# EAGLE design TramontanaPico (EAGLE 8.6.0)
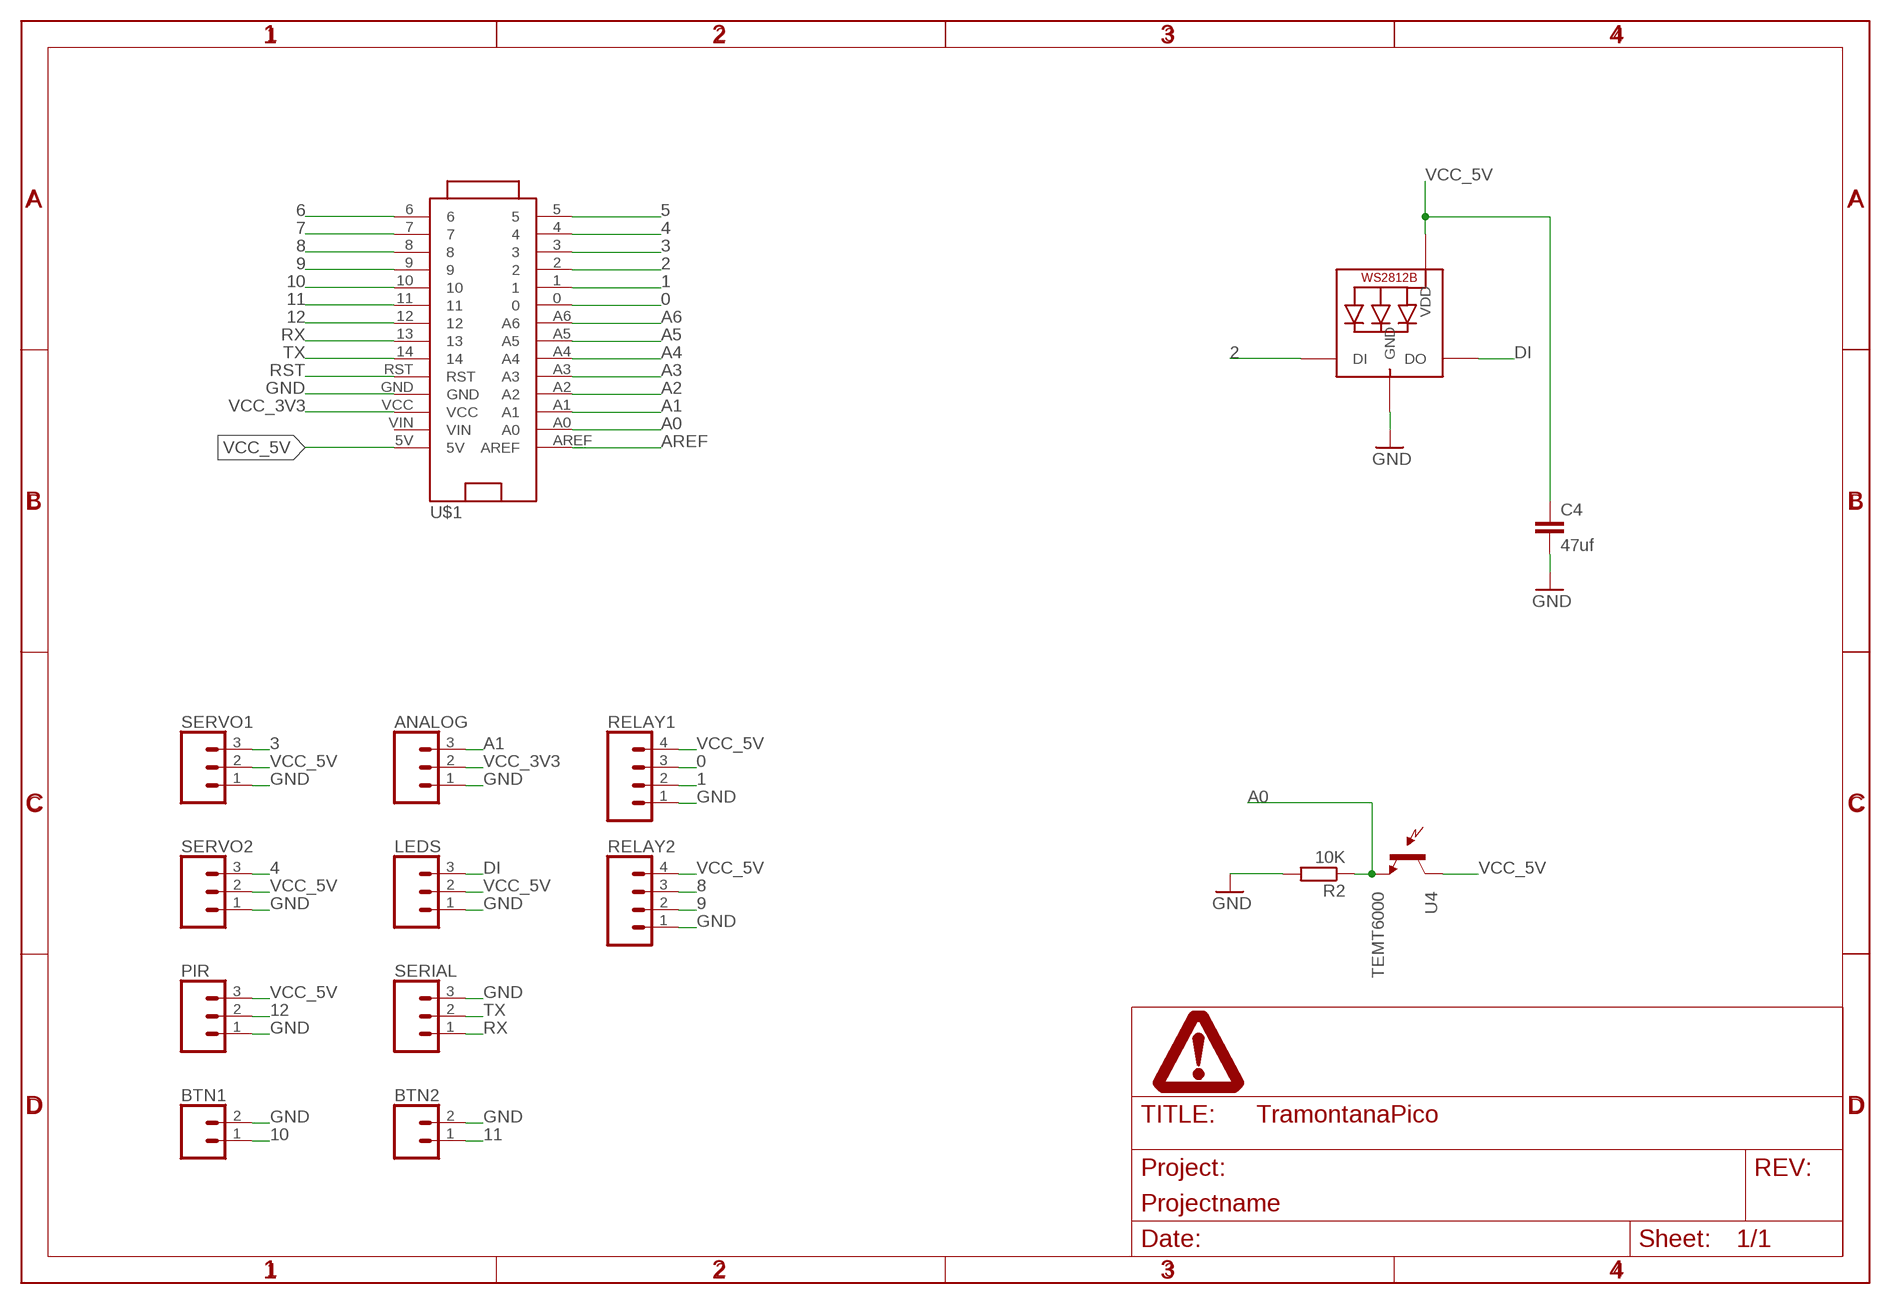
[diagram p0: schematic, sheet 1]

## Parts
ANALOG  CONN_03LOCK  [1X03_LOCK]
BTN1  CONN_02LOCK  [1X02_LOCK]
BTN2  CONN_02LOCK  [1X02_LOCK]
C4  47uf  C-EUC0603  [C0603]
HTTP  FRAME_DINA4_L  [DP_LOGO]
LED1  WS2812B5050  [WS2812B]
LEDS  CONN_03LOCK  [1X03_LOCK]
PIR  CONN_03LOCK  [1X03_LOCK]
R2  10K  R-EU_R0603  [R0603]
RELAY1  CONN_04LOCK  [1X04_LOCK]
RELAY2  CONN_04LOCK  [1X04_LOCK]
SERIAL  CONN_03LOCK  [1X03_LOCK]
SERVO1  CONN_03LOCK  [1X03_LOCK]
SERVO2  CONN_03LOCK  [1X03_LOCK]
U4  TEMT6000  [TEMT6000-SEN]
U$1  MKR1000  [MKR1000]

## Nets
0: RELAY1.3 U$1.0
1: RELAY1.2 U$1.1
2: LED1.4-DIN(DI) U$1.2
3: SERVO1.3 U$1.3
4: SERVO2.3 U$1.4
5: U$1.5
6: U$1.6
7: U$1.7
8: RELAY2.3 U$1.8
9: RELAY2.2 U$1.9
10: BTN1.1 U$1.10
11: BTN2.1 U$1.11
12: PIR.2 U$1.12
A0: R2.1 U4.EMITTER(E1) U$1.A0
A1: ANALOG.3 U$1.A1
A2: U$1.A2
A3: U$1.A3
A4: U$1.A4
A5: U$1.A5
A6: U$1.A6
AREF: U$1.AREF
DI: LED1.2-DOUT(DO) LEDS.3
GND: ANALOG.1 BTN1.2 BTN2.2 C4.2 LED1.3-GND(GND) LEDS.1 PIR.1 R2.2 RELAY1.1 RELAY2.1 SERIAL.3 SERVO1.1 SERVO2.1 U$1.GND
RST: U$1.RST
RX: SERIAL.1 U$1.13
TX: SERIAL.2 U$1.14
VCC_3V3: ANALOG.2 U$1.VCC
VCC_5V: C4.1 LED1.1-VDD(VDD) LEDS.2 PIR.3 RELAY1.4 RELAY2.4 SERVO1.2 SERVO2.2 U4.COLLECTOR(C1) U$1.5V
Unconnected: U$1.VIN

## Library data of the parts
ANALOG LEDS PIR SERIAL SERVO1 SERVO2 = SparkFun-Connectors:CONN_03: Multi connection point. Often used as Generic Header-pin footprint for 0.1 inch spaced/style header connections On any of the 0.1 inch spaced packages, you can populate with these: Break Away Headers - Straight <https://www.sparkfun.com/products/116> (PRT-00116) Break Away Male Headers - Right Angle <https://www.sparkfun.com/products/553> (PRT-00553) Female Headers <https://www.sparkfun.com/products/115> (PRT-00115) Break Away Headers - Machine Pin <https://www.sparkfun.com/products/117> (PRT-00117) Break Away Female Headers - Swiss Machine Pin <https://www.sparkfun.com/products/743> (PRT-00743) Stackable Header - 3 Pin (Female, 0.1") <https://www.sparkfun.com/products/13875> (PRT-13875) For SCREWTERMINALS and SPRING TERMINALS visit here: Screw Terimnals on SparkFun.com <https://www.sparkfun.com/search/results?term=Screw+Terminals> (5mm/3.5mm/2.54mm spacing) This device is also useful as a general connection point to wire up your design to another part of your project. Our various solder wires solder well into these plated through hole pads. Hook-Up Wire - Assortment (Stranded, 22 AWG) <https://www.sparkfun.com/products/11375> (PRT-11375) Hook-Up Wire - Assortment (Solid Core, 22 AWG) <https://www.sparkfun.com/products/11367> (PRT-11367) View the entire wire category on our website here <https://www.sparkfun.com/categories/141> Special notes: Molex polarized connector foot print use with SKU : PRT-08232 with associated crimp pins and housings.
BTN1 BTN2 = SparkFun-Connectors:CONN_02: Multi connection point. Often used as Generic Header-pin footprint for 0.1 inch spaced/style header connections On any of the 0.1 inch spaced packages, you can populate with these: Break Away Headers - Straight <https://www.sparkfun.com/products/116> (PRT-00116) Break Away Male Headers - Right Angle <https://www.sparkfun.com/products/553> (PRT-00553) Female Headers <https://www.sparkfun.com/products/115> (PRT-00115) Break Away Headers - Machine Pin <https://www.sparkfun.com/products/117> (PRT-00117) Break Away Female Headers - Swiss Machine Pin <https://www.sparkfun.com/products/743> (PRT-00743) For SCREWTERMINALS and SPRING TERMINALS visit here: Screw Terimnals on SparkFun.com <https://www.sparkfun.com/search/results?term=Screw+Terminals> (5mm/3.5mm/2.54mm spacing) This device is also useful as a general connection point to wire up your design to another part of your project. Our various solder wires solder well into these plated through hole pads. Hook-Up Wire - Assortment (Stranded, 22 AWG) <https://www.sparkfun.com/products/11375> (PRT-11375) Hook-Up Wire - Assortment (Solid Core, 22 AWG) <https://www.sparkfun.com/products/11367> (PRT-11367) View the entire wire category on our website here <https://www.sparkfun.com/categories/141> Special notes: Molex polarized connector foot print use with: PRT-08233 with associated crimp pins and housings. 2.54_SCREWTERM for use with PRT-10571. 3.5mm Screw Terminal footprints for PRT-08084 5mm Screw Terminal footprints for use with PRT-08432
C4 = rcl:C-EU: CAPACITOR, European symbol
HTTP = dp_devices:FRAME_DINA4_L: A4 DP frame Standard Dangerous Prototypes schematic frame. Automagically adds the DP logo and standard texts to the PCB Use the atrribute in the schematic editor to change the fields.; FF1: fulfillment by; FF2: Seeed Studio; FF3: www.seeedstudio.com; LICENSE: CC-BY-SA; PROJECT: Projectname; URL1: http://; URL2: DangerousPrototypes.com
LED1 = adafruit:WS2812B
R2 = rcl:R-EU_: RESISTOR, European symbol
RELAY1 RELAY2 = SparkFun-Connectors:CONN_04: Multi connection point. Often used as Generic Header-pin footprint for 0.1 inch spaced/style header connections On any of the 0.1 inch spaced packages, you can populate with these: Break Away Headers - Straight <https://www.sparkfun.com/products/116> (PRT-00116) Break Away Male Headers - Right Angle <https://www.sparkfun.com/products/553> (PRT-00553) Female Headers <https://www.sparkfun.com/products/115> (PRT-00115) Break Away Headers - Machine Pin <https://www.sparkfun.com/products/117> (PRT-00117) Break Away Female Headers - Swiss Machine Pin <https://www.sparkfun.com/products/743> (PRT-00743) For SCREWTERMINALS and SPRING TERMINALS visit here: Screw Terimnals on SparkFun.com <https://www.sparkfun.com/search/results?term=Screw+Terminals> (5mm/3.5mm/2.54mm spacing) This device is also useful as a general connection point to wire up your design to another part of your project. Our various solder wires solder well into these plated through hole pads. Hook-Up Wire - Assortment (Stranded, 22 AWG) <https://www.sparkfun.com/products/11375> (PRT-11375) Hook-Up Wire - Assortment (Solid Core, 22 AWG) <https://www.sparkfun.com/products/11367> (PRT-11367) View the entire wire category on our website here <https://www.sparkfun.com/categories/141> Special notes: Molex polarized connector foot print use with SKU : PRT-08231 with associated crimp pins and housings. 1MM SMD Version SKU: PRT-10208; PROD_ID: CONN-09696
U4 = SparkFun:TEMT6000: Ambient Light Sensor Simple light detection sensor. Output varies with light intensity input. Spark Fun Electronics SKU : COM-08348
U$1 = MRK1000:MKR1000

## Board
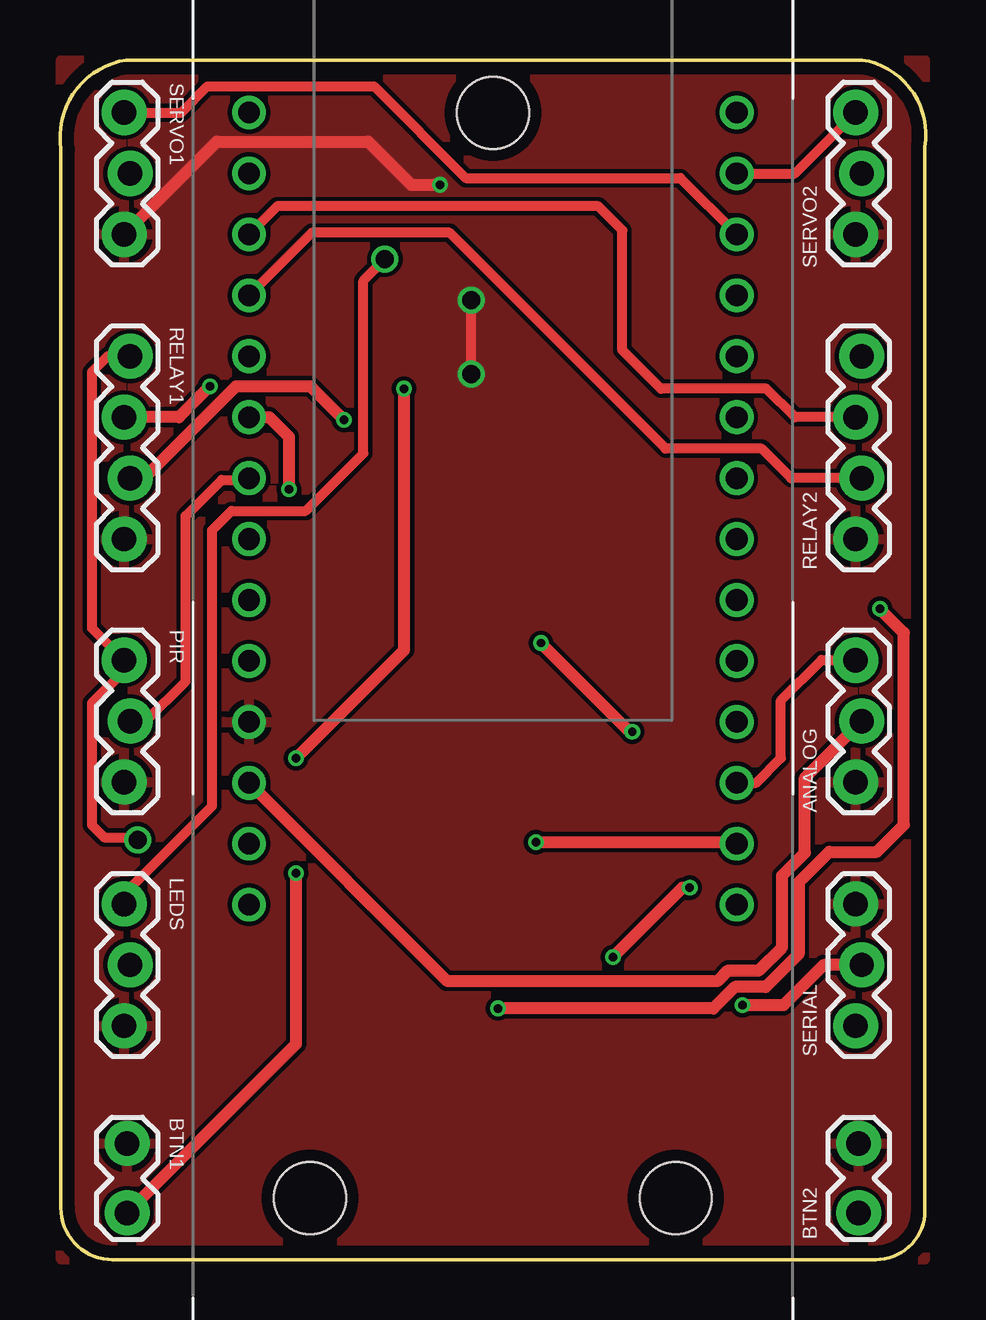
[diagram p1: board, top side]
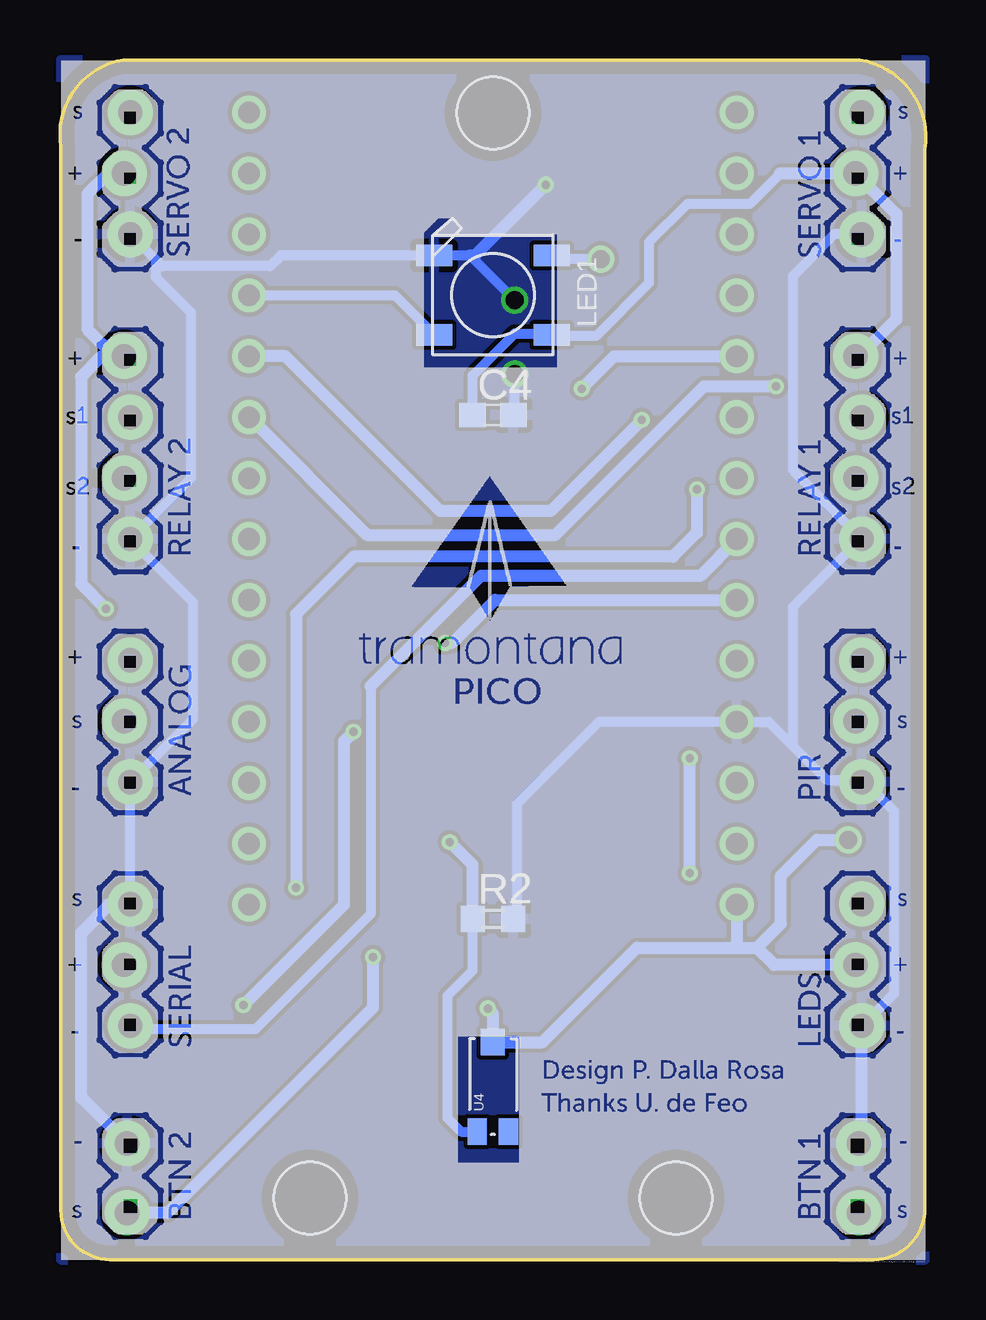
[diagram p2: board, bottom side, seen from below]

Size 36.08 x 50 mm. Coordinates in mm from the lower left corner, seen from the top.
Outline: 36.04,46.39 36.04,2.04 arc-90 33.99,0 2.19,0 arc-90 0.04,2.15 0.04,46.28 arc-90 2.76,50 33.43,50 arc-90 36.04,46.39
Copper layers (1*16): Top 0.035mm / dielectric 1.5mm / Bottom 0.035mm
Design rules "ShenZhen2U_2layer_EagleRules": minimum track width 7mil, minimum drill 12mil, track to track 7mil, track to pad 7mil, pad to pad 7mil, via to via 7mil, smd to smd 0mil, copper to edge 20mil, drill to drill 10mil, minimum pad ring 10mil, minimum via ring 6mil, stop-mask expansion 2mil, vias tented up to drill 25mil, thermal gap 10mil
Holes 3 mm at 10.42,2.56 25.66,2.56 18.04,47.8

### Footprints (pad centres in the part's own frame; a part is rotated, then mirrored left to right if it is on the bottom)
1X03_LOCK = drill 1.016 pad 1.88: 1 0,0.127; 2 2.54,-0.127; 3 5.08,0.127
1X02_LOCK = drill 1.016 pad 1.88: 1 -0.178,0; 2 2.718,0
C0603 = smd 1.1 x 1: 1 -0.85,0; 2 0.85,0
WS2812B = smd 1.5 x 0.9: 1-VDD 2.45,-1.65; 2-DOUT 2.45,1.65; 3-GND -2.45,1.65; 4-DIN -2.45,-1.65
R0603 = smd 1 x 1.1: 1 -0.85,0; 2 0.85,0
1X04_LOCK = drill 1.016 pad 1.88: 1 0,0.127; 2 2.54,-0.127; 3 5.08,0.127; 4 7.62,-0.127
TEMT6000-SEN = smd 1.1 x 0.8: BASE -1.87,-0.65; EMITTER -1.87,0.65 | smd 1.1 x 1: COLLECTOR 1.86,0.01
MKR1000 = drill 0.9: 0 10.16,11.704; 1 10.16,14.244; 2 10.16,16.784; 3 10.16,19.324; 4 10.16,21.864; 5 10.16,24.404; 5V -10.16,-8.616; 6 -10.16,24.404; 7 -10.16,21.864; 8 -10.16,19.324; 9 -10.16,16.784; 10 -10.16,14.244; 11 -10.16,11.704; 12 -10.16,9.164; 13 -10.16,6.624; 14 -10.16,4.084; A0 10.16,-6.076; A1 10.16,-3.536; A2 10.16,-0.996; A3 10.16,1.544; A4 10.16,4.084; A5 10.16,6.624; A6 10.16,9.164; AREF 10.16,-8.616; GND -10.16,-0.996; RST -10.16,1.544; VCC -10.16,-3.536; VIN -10.16,-6.076

### Placement (x,y rotation side)
ANALOG  33.28,19.9 90 top
BTN1  2.8,2.12 90 top
BTN2  33.28,2.12 90 top
C4  18.04,35.2 0 bottom
HTTP  -3.96,-25 0 top  (outside the outline)
LED1  18.04,40.2 0 bottom
LEDS  2.8,9.74 90 top
PIR  2.8,19.9 90 top
R2  18.04,14.2 0 bottom
RELAY1  2.8,30.03 90 top
RELAY2  33.28,30.03 90 top
SERIAL  33.28,9.74 90 top
SERVO1  2.8,42.73 90 top
SERVO2  33.28,42.73 90 top
U4  18.04,7.2 90 bottom
U$1  18.04,23.41 0 top

### Tracks (layer width: path | path; a pad name or v marks a point on that pad's centre or on a via)
0  (via drill 0.35)
  Top 0.508: v6.24,36.4 4.96,35.11 RELAY1.3
  Bottom 0.508: U$1.0 23.29,30.2 15.44,30.2 9.24,36.4 v6.24,36.4
1  (via drill 0.35)
  Top 0.508: RELAY1.2 3.51,32.57 7.34,36.4 10.04,36.4 10.44,36.4 v11.84,35
  Bottom 0.508: v11.84,35 15.64,31.2 20.24,31.2 26.69,37.65 U$1.1
2
  Bottom 0.406: U$1.2 22.13,40.19 LED1.4-DIN
3
  Top 0.406: SERVO1.3 5.05,47.81 6.14,48.91 13.09,48.91 16.91,45.08 25.85,45.08 U$1.3
4
  Top 0.406: U$1.4 30.61,45.27 SERVO2.3
8
  Top 0.406: U$1.8 9.05,43.9 22.44,43.9 23.44,42.9 23.44,37.9 25.04,36.3 29.44,36.3 30.63,35.11 RELAY2.3
9
  Top 0.406: RELAY2.2 30.47,32.57 29.24,33.8 25.24,33.8 16.24,42.8 10.49,42.8 U$1.9
10  (via drill 0.35)
  Top 0.508: BTN1.1 9.84,8.98 v9.84,16.1 | v9.84,20.9 14.34,25.4 v14.34,36.3
  Bottom 0.508: v9.84,16.1 v9.84,20.9 | v14.34,36.3 12.99,37.65 U$1.10
11  (via drill 0.35)
  Top 0.508: U$1.11 8.73,35.11 9.54,34.3 v9.54,32.1 | v26.24,15.5 25.94,15.5 v23.04,12.6
  Bottom 0.508: v9.54,32.1 9.54,30.3 10.54,29.3 23.84,29.3 26.24,26.9 v26.24,15.5 | v23.04,12.6 23.04,10.5 31.59,1.94 BTN2.1
12
  Top 0.406: PIR.2 3.58,22.44 5.24,24.1 5.24,31 6.74,32.5 7.81,32.5 U$1.12
A0  (via drill 0.35)
  Top 0.508: v19.84,17.4 28.13,17.4 U$1.A0
  Bottom 0.406: R2.1 18.89,12.05 19.94,11 19.94,5.9 19.37,5.33 U4.EMITTER
  Bottom 0.508: R2.1 18.89,16.45 v19.84,17.4
A1
  Top 0.406: U$1.A1 29.01,19.87 30.04,20.9 30.04,23.3 31.74,25 33.13,25 ANALOG.3
DI  (via drill 0.75 pad 0.65)
  Top 0.406: LEDS.3 2.67,15.23 6.34,18.9 6.34,30.4 7.14,31.2 10.24,31.2 12.64,33.6 12.64,40.8 v13.54,41.7
  Bottom 0.406: v13.54,41.7 15.44,41.7 LED1.2-DOUT
GND  (via drill 0.35, 0.75 pad 0.65)
  Top 0.406: v17.14,36.9 v17.14,40
  Top 0.508: SERVO1.1 6.54,46.6 12.84,46.6 14.64,44.8 v15.84,44.8
  Bottom 0.406: 32.09,41.67 SERVO2.1 | 32.09,41.67 32.09,40.95 30.64,39.5 30.64,32.54 RELAY2.1 33.15,30.01 30.54,27.4 30.54,22.51 ANALOG.1 33.15,14.84 SERIAL.3 | SERVO1.1 3.81,42.73 5.54,41 5.54,32.9 RELAY1.1 2.71,30.03 5.54,27.2 5.54,21.4 | 5.54,21.4 4.14,20 2.77,20 PIR.1 2.54,19.9 1.33,18.7 1.33,11.08 LEDS.1 | 7.78,22.41 U$1.GND | 7.78,22.41 6.55,22.41 5.54,21.4 | 7.78,22.41 7.79,22.4 13.64,22.4 17.04,19 17.04,14.35 R2.2 | v17.14,40 18.99,41.85 LED1.3-GND 26.89,41.85 27.34,41.4 31.82,41.4 32.09,41.67 | 17.14,35.25 v17.14,36.9 | 17.14,35.25 C4.2 | 17.09,35.2 17.14,35.25
  Bottom 0.508: BTN1.2 2.67,4.96 LEDS.1 | BTN2.2 35.2,6.76 35.2,13.6 33.96,14.84 33.15,14.84 | v15.84,44.8 18.79,41.85 18.99,41.85
  pour Bottom: 0.04,0 0.04,50 36.04,50 36.04,0
  pour Top: 0.04,0 0.04,50 36.04,50 36.04,0
RX
  Bottom 0.406: 23.14,23.9 23.14,14.4 27.94,9.6 33.01,9.6 SERIAL.1
  Bottom 0.508: U$1.13 9.41,28.5 18.54,28.5 23.14,23.9
TX  (via drill 0.35)
  Top 0.508: 32.76,12.28 SERIAL.2 31.82,12.28 30.14,10.6 v28.44,10.6 | v23.84,22 23.74,22 v20.04,25.7
  Bottom 0.508: U$1.14 17.95,27.49 19.74,25.7 v20.04,25.7 | v28.44,10.6 24.24,14.8 24.24,21.61 v23.84,22
VCC_3V3
  Top 0.508: U$1.VCC 16.12,11.62 27.42,11.62 27.84,12.04 29.11,12.04 30.08,13.02 30.08,16 31.04,16.95 31.04,20.07 ANALOG.2
VCC_5V  (via drill 0.35, 0.75 pad 0.65)
  Top 0.406: RELAY1.4 1.99,37.65 1.33,36.99 1.33,26.32 PIR.3 | PIR.3 2.62,24.98 | PIR.3 2.67,24.53 1.33,23.2 1.33,18.11 1.84,17.6 3.14,17.6 v3.24,17.5
  Top 0.508: v18.25,10.46 27.23,10.46 28.12,11.36 29.4,11.36 30.77,12.73 30.77,15.72 32.05,17 34.04,17 35.16,18.12 35.16,26.12 v34.16,27.12
  Bottom 0.406: v3.24,17.5 3.44,17.5 | 6.07,45.27 7.34,44 9.94,44 11.54,42.4 11.54,40.7 13.74,38.5 15.54,38.5 LED1.1-VDD 15.64,38.6 17.14,38.6 18.89,36.85 C4.1
  Bottom 0.508: 33.8,37.65 34.35,37.65 35.2,36.8 35.2,28.16 v34.16,27.12 | 33.8,37.65 RELAY2.4 | SERVO2.2 34.06,45.27 34.94,44.4 34.94,38.78 33.8,37.65 | RELAY1.4 2.77,37.65 1.23,39.19 1.23,43.58 SERVO1.2 6.07,45.27 | v18.25,10.46 18.05,10.26 U4.COLLECTOR 15.98,9.06 12.04,13 8.04,13 | 7.04,13 6.04,14 6.04,16 4.54,17.5 v3.24,17.5 3.41,17.33 | 8.04,13 7.04,13 | LEDS.2 6.32,12.28 7.04,13 | U$1.5V 7.88,13.16 8.04,13

### Text on the board
_tsilk: /Users/pierluigi.dallarosa/Documents/eagle/Tramontana_Pico/_archive/SILK_TOP_TramontanaPico.bmp
_bsilk: /Users/pierluigi.dallarosa/Documents/eagle/Tramontana_Pico/_archive/SILK_BOTTOM_TramontanaPico.bmp